# Altium schematic sheet 9-Potentiometers.SchDoc
size A4
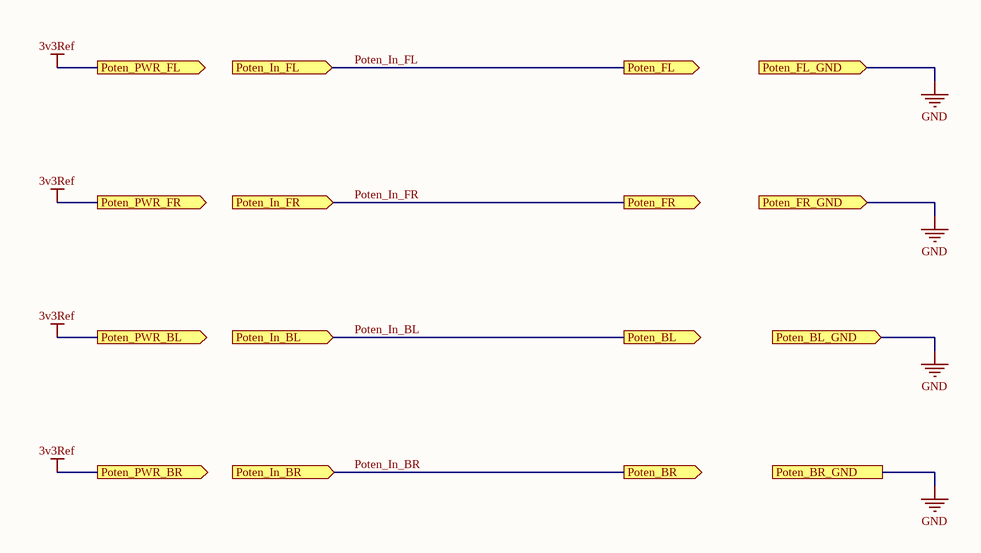
[diagram p0: 9-Potentiometers.SchDoc]

## Ports
Poten_BL (out), Poten_BL_GND (in), Poten_BR (out), Poten_BR_GND, Poten_FL (out), Poten_FL_GND (in), Poten_FR (out), Poten_FR_GND (in), Poten_In_BL (in), Poten_In_BR (in), Poten_In_FL (in), Poten_In_FR (in), Poten_PWR_BL (out), Poten_PWR_BR (out), Poten_PWR_FL (out), Poten_PWR_FR (out)

## Nets
3v3Ref: port Poten_PWR_FL, port Poten_PWR_FR, port Poten_PWR_BL, port Poten_PWR_BR
GND: port Poten_FL_GND, port Poten_FR_GND, port Poten_BL_GND, port Poten_BR_GND
Poten_In_BL: port Poten_In_BL, port Poten_BL
Poten_In_BR: port Poten_In_BR, port Poten_BR
Poten_In_FL: port Poten_In_FL, port Poten_FL
Poten_In_FR: port Poten_In_FR, port Poten_FR